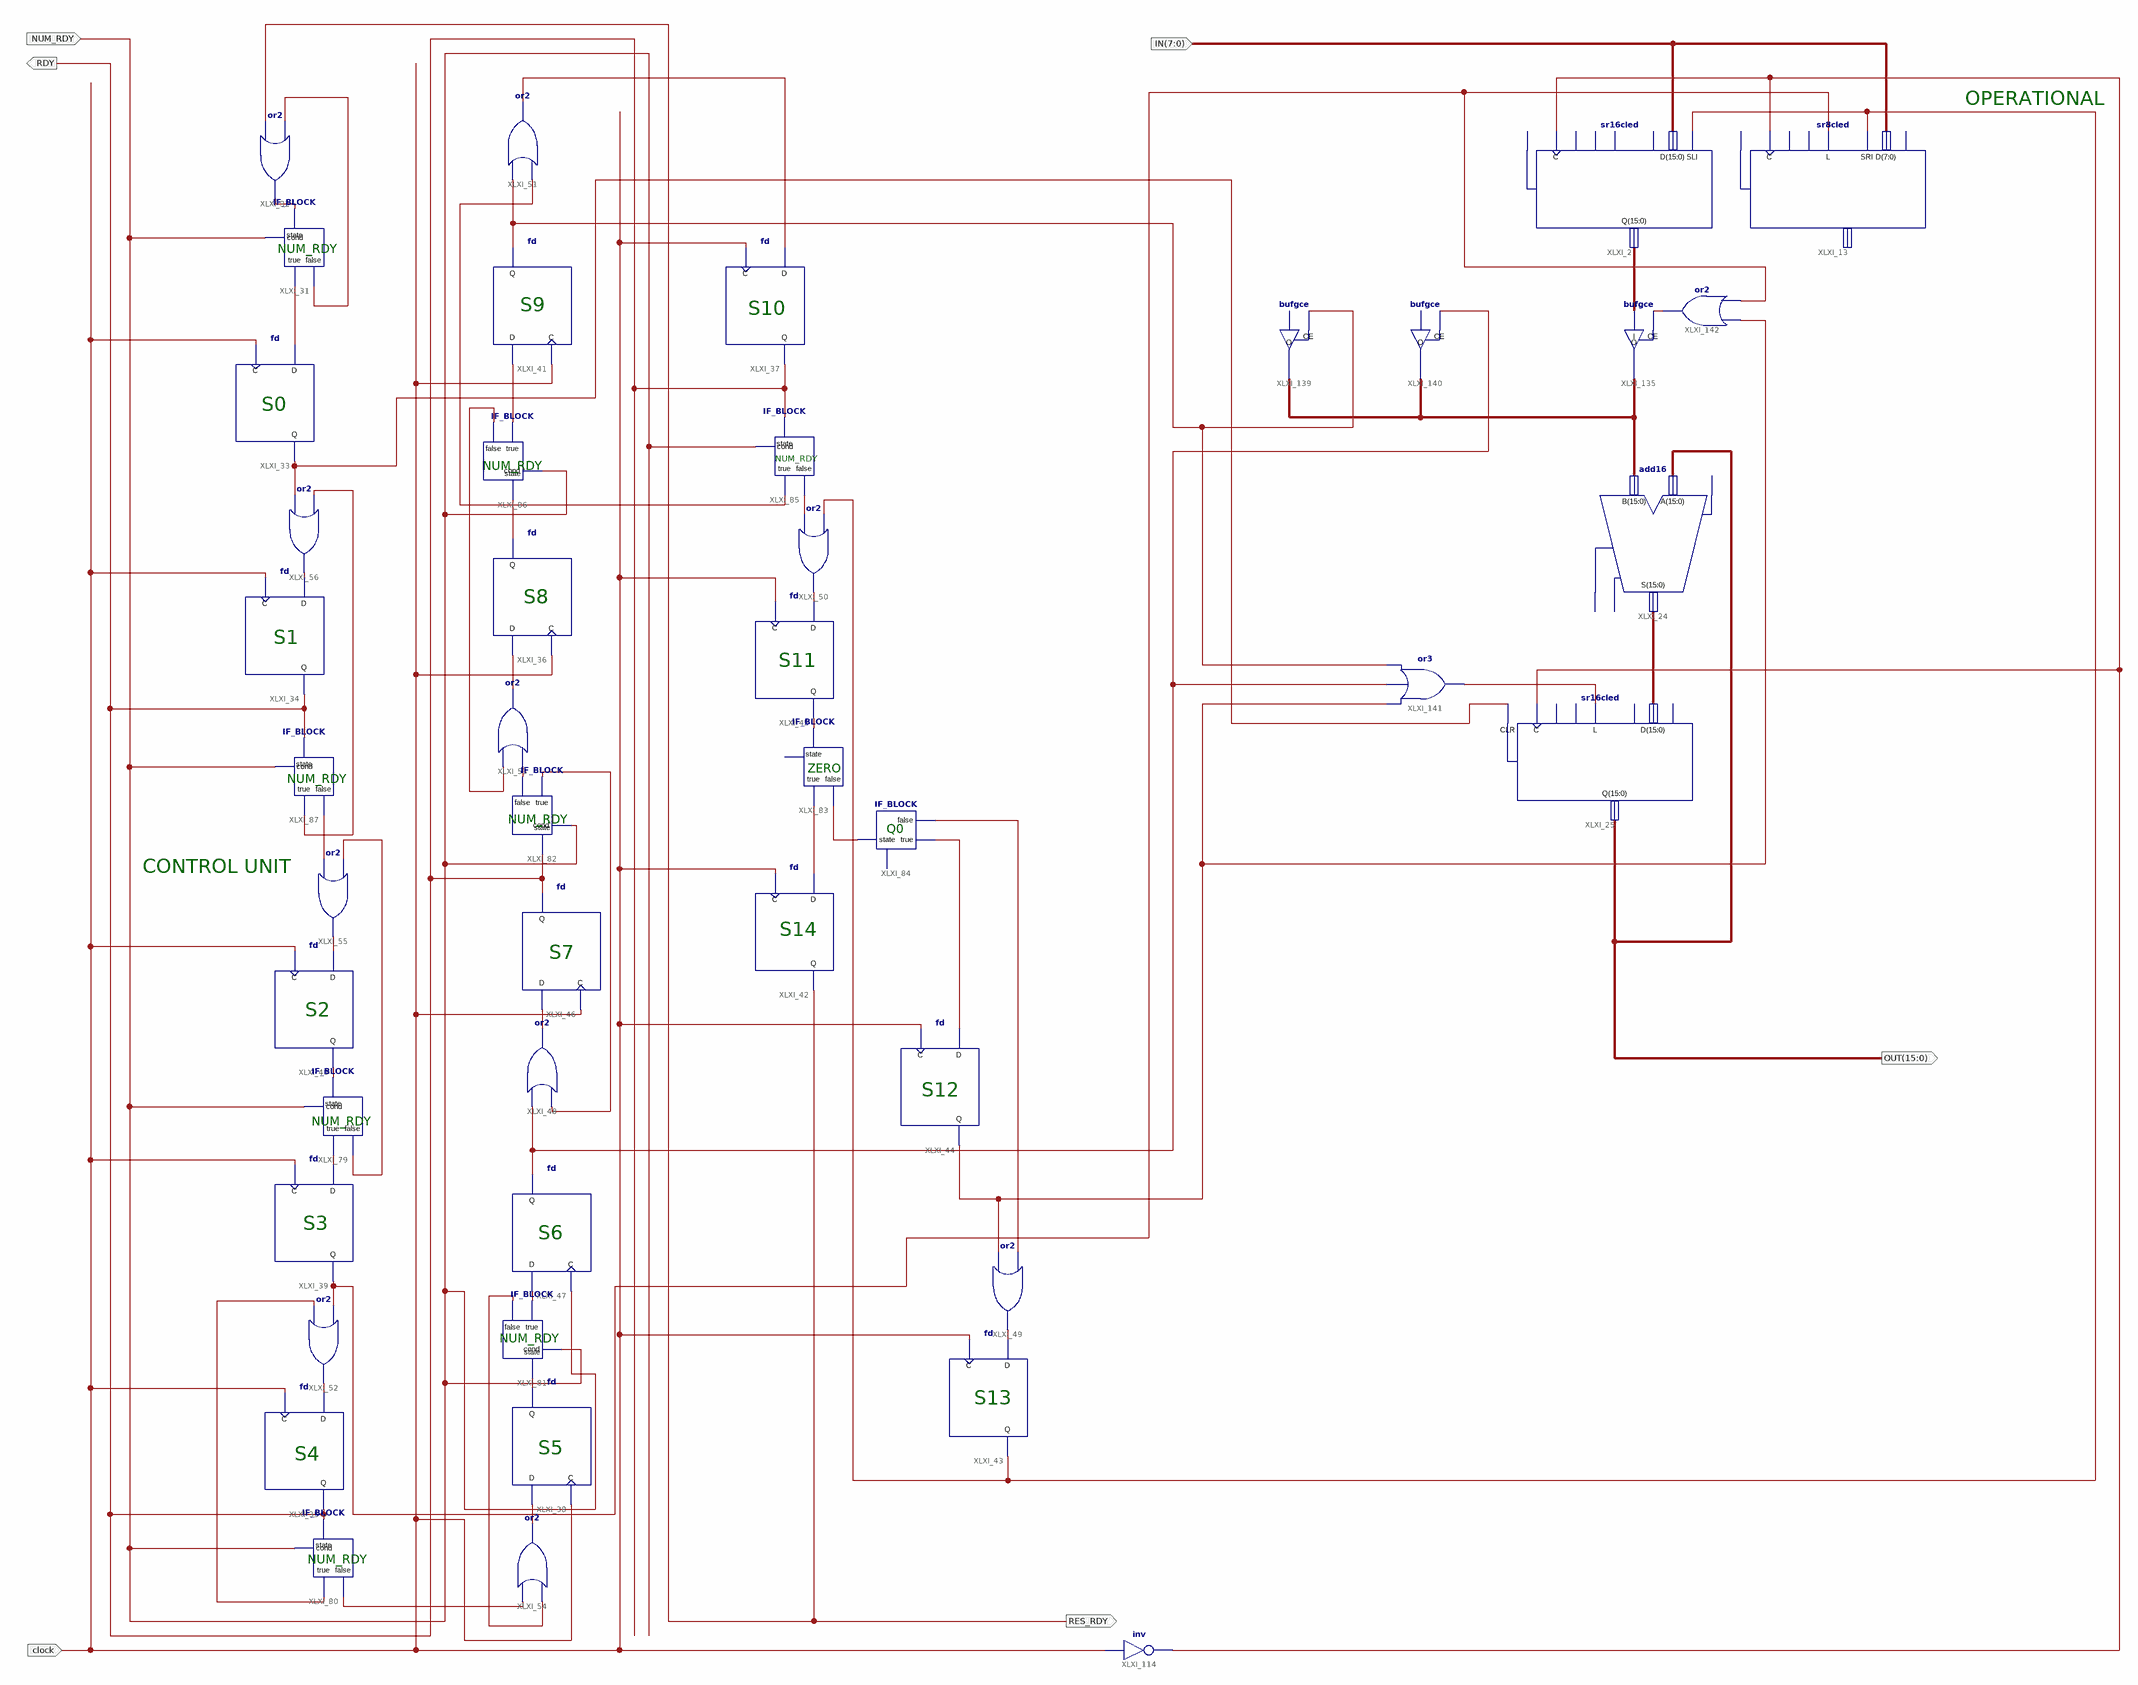
[diagram p0: schematic sheet 1]
// Xilinx ISE schematic helloworld.sch (spartan6) as structural Verilog: 45 symbols, 6 ports
module helloworld (
  input  NUM_RDY,
  input  clock,
  input  [7:0] IN,
  output RDY,
  output RES_RDY,
  output [15:0] OUT
);

  wire XLXN_22, XLXN_27, XLXN_30, XLXN_33, XLXN_34, XLXN_35, XLXN_41, XLXN_42, XLXN_43, XLXN_44, XLXN_45,
       XLXN_46, XLXN_52, XLXN_54, XLXN_56, XLXN_57, XLXN_59, XLXN_65, XLXN_67, XLXN_72, XLXN_74, XLXN_76,
       XLXN_77, XLXN_78, XLXN_80, XLXN_81, XLXN_82, XLXN_83, XLXN_103, XLXN_104, XLXN_105, XLXN_106,
       XLXN_108, XLXN_109, XLXN_111, XLXN_113, XLXN_114, XLXN_117, XLXN_119, XLXN_121, XLXN_122, XLXN_124,
       XLXN_125;
  wire [15:0] XLXN_19, XLXN_115, XLXN_116;

  IF_BLOCK XLXI_31 (.cond(NUM_RDY), .false(XLXN_34), .state(XLXN_22), .true(XLXN_33));
  or XLXI_32 (XLXN_22, RES_RDY, XLXN_34);
  fd XLXI_33 (.C(clock), .D(XLXN_33), .Q(XLXN_27));
  or XLXI_56 (XLXN_30, XLXN_27, XLXN_35);
  fd XLXI_34 (.C(clock), .D(XLXN_30), .Q(RDY));
  fd XLXI_39 (.C(clock), .D(XLXN_45), .Q(XLXN_119));
  fd XLXI_40 (.C(clock), .D(XLXN_43), .Q(XLXN_44));
  or XLXI_55 (XLXN_43, XLXN_41, XLXN_42);
  IF_BLOCK XLXI_87 (.cond(NUM_RDY), .false(XLXN_41), .state(RDY), .true(XLXN_35));
  IF_BLOCK XLXI_79 (.cond(NUM_RDY), .false(XLXN_42), .state(XLXN_44), .true(XLXN_45));
  IF_BLOCK XLXI_80 (.cond(NUM_RDY), .false(XLXN_54), .state(RDY), .true(XLXN_52));
  IF_BLOCK XLXI_81 (.cond(NUM_RDY), .false(XLXN_59), .state(XLXN_57), .true(XLXN_65));
  IF_BLOCK XLXI_82 (.cond(NUM_RDY), .false(XLXN_74), .state(RDY), .true(XLXN_72));
  IF_BLOCK XLXI_85 (.cond(NUM_RDY), .false(XLXN_103), .state(RDY), .true(XLXN_82));
  IF_BLOCK XLXI_86 (.cond(NUM_RDY), .false(XLXN_78), .state(XLXN_77), .true(XLXN_80));
  or XLXI_52 (XLXN_46, XLXN_52, XLXN_119);
  or XLXI_48 (XLXN_67, XLXN_72, XLXN_121);
  or XLXI_54 (XLXN_56, XLXN_59, XLXN_54);
  or XLXI_51 (XLXN_83, XLXN_82, XLXN_81);
  or XLXI_53 (XLXN_76, XLXN_74, XLXN_78);
  fd XLXI_36 (.C(clock), .D(XLXN_76), .Q(XLXN_77));
  fd XLXI_37 (.C(clock), .D(XLXN_83), .Q(RDY));
  fd XLXI_41 (.C(clock), .D(XLXN_80), .Q(XLXN_81));
  fd XLXI_42 (.C(clock), .D(XLXN_106), .Q(RES_RDY));
  fd XLXI_43 (.C(clock), .D(XLXN_111), .Q(XLXN_125));
  fd XLXI_44 (.C(clock), .D(XLXN_109), .Q(XLXN_114));
  fd XLXI_45 (.C(clock), .D(XLXN_104), .Q(XLXN_105));
  fd XLXI_46 (.C(clock), .D(XLXN_67), .Q(RDY));
  fd XLXI_47 (.C(NUM_RDY), .D(XLXN_65), .Q(XLXN_121));
  fd XLXI_35 (.C(clock), .D(XLXN_46), .Q(RDY));
  fd XLXI_38 (.C(clock), .D(XLXN_56), .Q(XLXN_57));
  not XLXI_114 (XLXN_117, clock);
  sr8cled XLXI_13 (.C(XLXN_117), .D(IN), .L(XLXN_119), .SRI(XLXN_125));  // open: CE, CLR, LEFT, SLI, Q
  sr16cled XLXI_2 (.C(XLXN_117), .D(IN), .SLI(XLXN_125), .Q(XLXN_115));  // open: CE, CLR, L, LEFT, SRI
  add16 XLXI_24 (.A(OUT), .B(XLXN_116), .S(XLXN_19));  // open: CI, CO, OFL
  sr16cled XLXI_25 (.C(XLXN_117), .CLR(XLXN_27), .D(XLXN_19), .L(XLXN_122), .Q(OUT));  // open: CE, LEFT, SLI, SRI
  or XLXI_49 (XLXN_111, XLXN_114, XLXN_113);
  or XLXI_50 (XLXN_104, XLXN_103, XLXN_125);
  IF_BLOCK XLXI_83 (.false(XLXN_108), .state(XLXN_105), .true(XLXN_106));  // open: cond
  IF_BLOCK XLXI_84 (.false(XLXN_113), .state(XLXN_108), .true(XLXN_109));  // open: cond
  bufgce XLXI_135 (.CE(XLXN_124), .I(XLXN_115), .O(XLXN_116));
  bufgce XLXI_139 (.CE(XLXN_81), .O(XLXN_116));  // open: I
  bufgce XLXI_140 (.CE(XLXN_121), .O(XLXN_116));  // open: I
  or XLXI_141 (XLXN_122, XLXN_114, XLXN_121, XLXN_81);
  or XLXI_142 (XLXN_124, XLXN_119, XLXN_114);

  // Notes on the sheet:
  //   OPERATIONAL
  //   NUM_RDY
  //   S9
  //   S10
  //   S0
  //   NUM_RDY
  //   NUM_RDY
  //   S8
  //   S1
  //   S11
  //   ZERO
  //   NUM_RDY
  //   NUM_RDY
  //   Q0
  //   CONTROL UNIT
  //   S14
  //   S7
  //   S2
  //   S12
  //   NUM_RDY
  //   S3
  //   S6
  //   NUM_RDY
  //   S13
  //   S5
  //   S4
  //   NUM_RDY
endmodule
